# EAGLE design Projek1 (EAGLE 6.6.0)
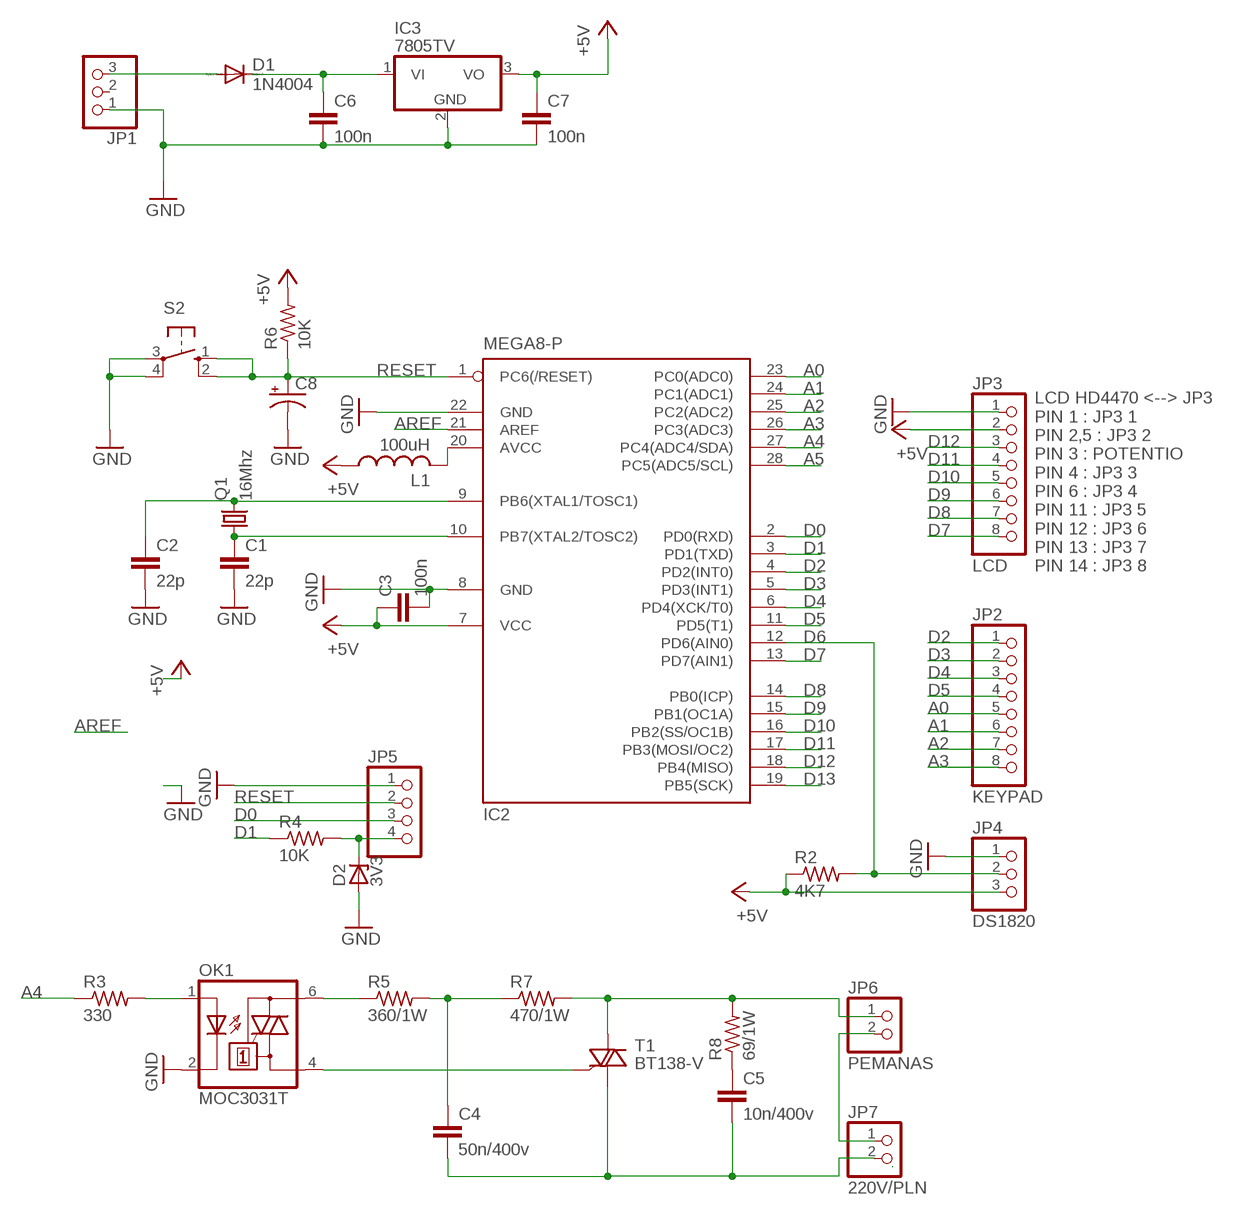
[diagram p0: schematic, sheet 1]

## Parts
C1  22p  C-EU025-025X050  [C025-025X050]
C2  22p  C-EU025-025X050  [C025-025X050]
C3  100n  C-EU050-025X075  [C050-025X075]
C4  50n/400v  C-EU150-064X183  [C150-064X183]
C5  10n/400v  C-EU150-064X183  [C150-064X183]
C6  100n  C-EU050-025X075  [C050-025X075]
C7  100n  C-EU050-025X075  [C050-025X075]
C8  CPOL-USE2-5  [E2-5]
D1  1N4004  [DO41-10]
D2  3V3  ZENER-DIODEDO35Z10  [DO35Z10]
IC2  MEGA8-P  [DIL28-3]
IC3  7805TV  [TO220V]
JP1  PINHD-1X3  [1X03]
JP2  KEYPAD  PINHD-1X8  [1X08]
JP3  LCD  PINHD-1X8  [1X08]
JP4  DS1820  PINHD-1X3  [1X03]
JP5  PINHD-1X4  [1X04]
JP6  PEMANAS  PINHD-1X2  [1X02]
JP7  220V/PLN  PINHD-1X2  [1X02]
L1  100uH  L-US0207/10  [0207/10]
OK1  MOC3031T  [DIL06B]
Q1  16Mhz  CRYSTALHC49U70  [HC49U70]
R2  4K7  R-US_0309/10  [0309/10]
R3  330  R-US_0309/10  [0309/10]
R4  10K  R-US_0309/10  [0309/10]
R5  360/1W  R-US_0414/15  [0414/15]
R6  10K  R-US_0309/10  [0309/10]
R7  470/1W  R-US_0414/15  [0414/15]
R8  69/1W  R-US_0414/15  [0414/15]
S2  10-XX  [B3F-10XX]
T1  BT138-V  [TO220BV]

## Nets
+5V [power]: C3.1 C7.1 IC2.7(VCC) IC3.3(VO) JP3.2 JP4.3 L1.1 R2.1 R6.2
A0: IC2.23(PC0(ADC0)) JP2.5
A1: IC2.24(PC1(ADC1)) JP2.6
A2: IC2.25(PC2(ADC2)) JP2.7
A3: IC2.26(PC3(ADC3)) JP2.8
A4: IC2.27(PC4(ADC4/SDA)) R3.1
A5: IC2.28(PC5(ADC5/SCL))
AREF: IC2.21(AREF)
D0: IC2.2(PD0(RXD)) JP5.3
D1: IC2.3(PD1(TXD)) R4.1
D2: IC2.4(PD2(INT0)) JP2.1
D3: IC2.5(PD3(INT1)) JP2.2
D4: IC2.6(PD4(XCK/T0)) JP2.3
D5: IC2.11(PD5(T1)) JP2.4
D6: IC2.12(PD6(AIN0)) JP4.2 R2.2
D7: IC2.13(PD7(AIN1)) JP3.8
D8: IC2.14(PB0(ICP)) JP3.7
D9: IC2.15(PB1(OC1A)) JP3.6
D10: IC2.16(PB2(SS/OC1B)) JP3.5
D11: IC2.17(PB3(MOSI/OC2)) JP3.4
D12: IC2.18(PB4(MISO)) JP3.3
D13: IC2.19(PB5(SCK))
GND: C1.2 C2.2 C3.2 C6.2 C7.2 C8.- D2.A IC2.8(GND) IC2.22(GND) IC3.2(GND) JP1.1 JP3.1 JP4.1 JP5.1 OK1.2(C) S2.3(P) S2.4(P1)
N$1: D1.A JP1.3
N$2: C2.1 IC2.9(PB6(XTAL1/TOSC1)) Q1.2
N$3: C1.1 IC2.10(PB7(XTAL2/TOSC2)) Q1.1
N$4: C6.1 D1.C IC3.1(VI)
N$5: IC2.20(AVCC) L1.2
N$6: OK1.1(A) R3.2
N$7: D2.C JP5.4 R4.2
N$8: OK1.4(A1) T1.G
N$9: JP6.1 R7.2 R8.2 T1.T2(A2)
N$10: OK1.6(A2) R5.1
N$11: C4.1 R5.2 R7.1
N$12: C4.2 C5.2 JP7.2 T1.T1(A1)
N$13: C5.1 R8.1
N$15: JP6.2 JP7.1
RESET: C8.+ IC2.1(PC6(/RESET)) JP5.2 R6.1 S2.1(S) S2.2(S1)
Unconnected: JP1.2

## Notes on the sheet
- LCD HD4470 <--> JP3
  PIN 1 : JP3 1
  PIN 2,5 : JP3 2
  PIN 3 : POTENTIO
  PIN 4 : JP3 3 
  PIN 6 : JP3 4
  PIN 11 : JP3 5
  PIN 12 : JP3 6
  PIN 13 : JP3 7
  PIN 14 : JP3 8

## Library data of the parts
C1-C7 = rcl:C-EU: CAPACITOR, European symbol
C8 = rcl:CPOL-US: POLARIZED CAPACITOR, American symbol
D1 = diode:1N4004: DIODE general purpose rectifier, 1 A
D2 = diode:ZENER-DIODE: Z-Diode
IC2 = atmel:MEGA8-P: MICROCONTROLLER 8 Kbytes FLASH, 1 kbytes SRAM, 512 bytes EEPROM, USART, 4-channel 10 bit ADC, 2-channel 8 bit ADC Pin compatible with Atmega48, ATMega88, ATMega168 Source: avr.lbr; OC_FARNELL: unknown; OC_NEWARK: unknown
IC3 = linear:78*: Positive VOLTAGE REGULATOR Source: http://cache.national.com/ds/LM/LM78L05.pdf http://www.fairchildsemi.com/ds/LM/LM7805.pdf
JP1 JP4 = pinhead:PINHD-1X3: PIN HEADER
JP2 JP3 = pinhead:PINHD-1X8: PIN HEADER
JP5 = pinhead:PINHD-1X4: PIN HEADER
JP6 JP7 = pinhead:PINHD-1X2: PIN HEADER
L1 = rcl:L-US: INDUCTOR, American symbol
OK1 = optocoupler:MOC30*: 6-Pin DIP Zero-Cross Optoisolators Triac Driver Output (250/400 Volt Peak) Source: Data sheet <http://www.fairchildsemi.com/ds/MO/MOC3031M.pdf> The old path of data sheet not more available 2013-05-06.; OC_FARNELL: unknown; OC_NEWARK: unknown
Q1 = crystal:CRYSTAL: CRYSTAL; OC_FARNELL: unknown; OC_NEWARK: unknown
R2-R8 = rcl:R-US_: RESISTOR, American symbol
S2 = switch-omron:10-XX: OMRON SWITCH; MPN: B3F-1000; OC_FARNELL: 176432; OC_NEWARK: 36M3542
T1 = triac:BT138: TRIAC Source: http://www.semiconductors.philips.com BT138_SERIES_2.pdf

## Net classes
1 power: width 0.61 mm

## Board
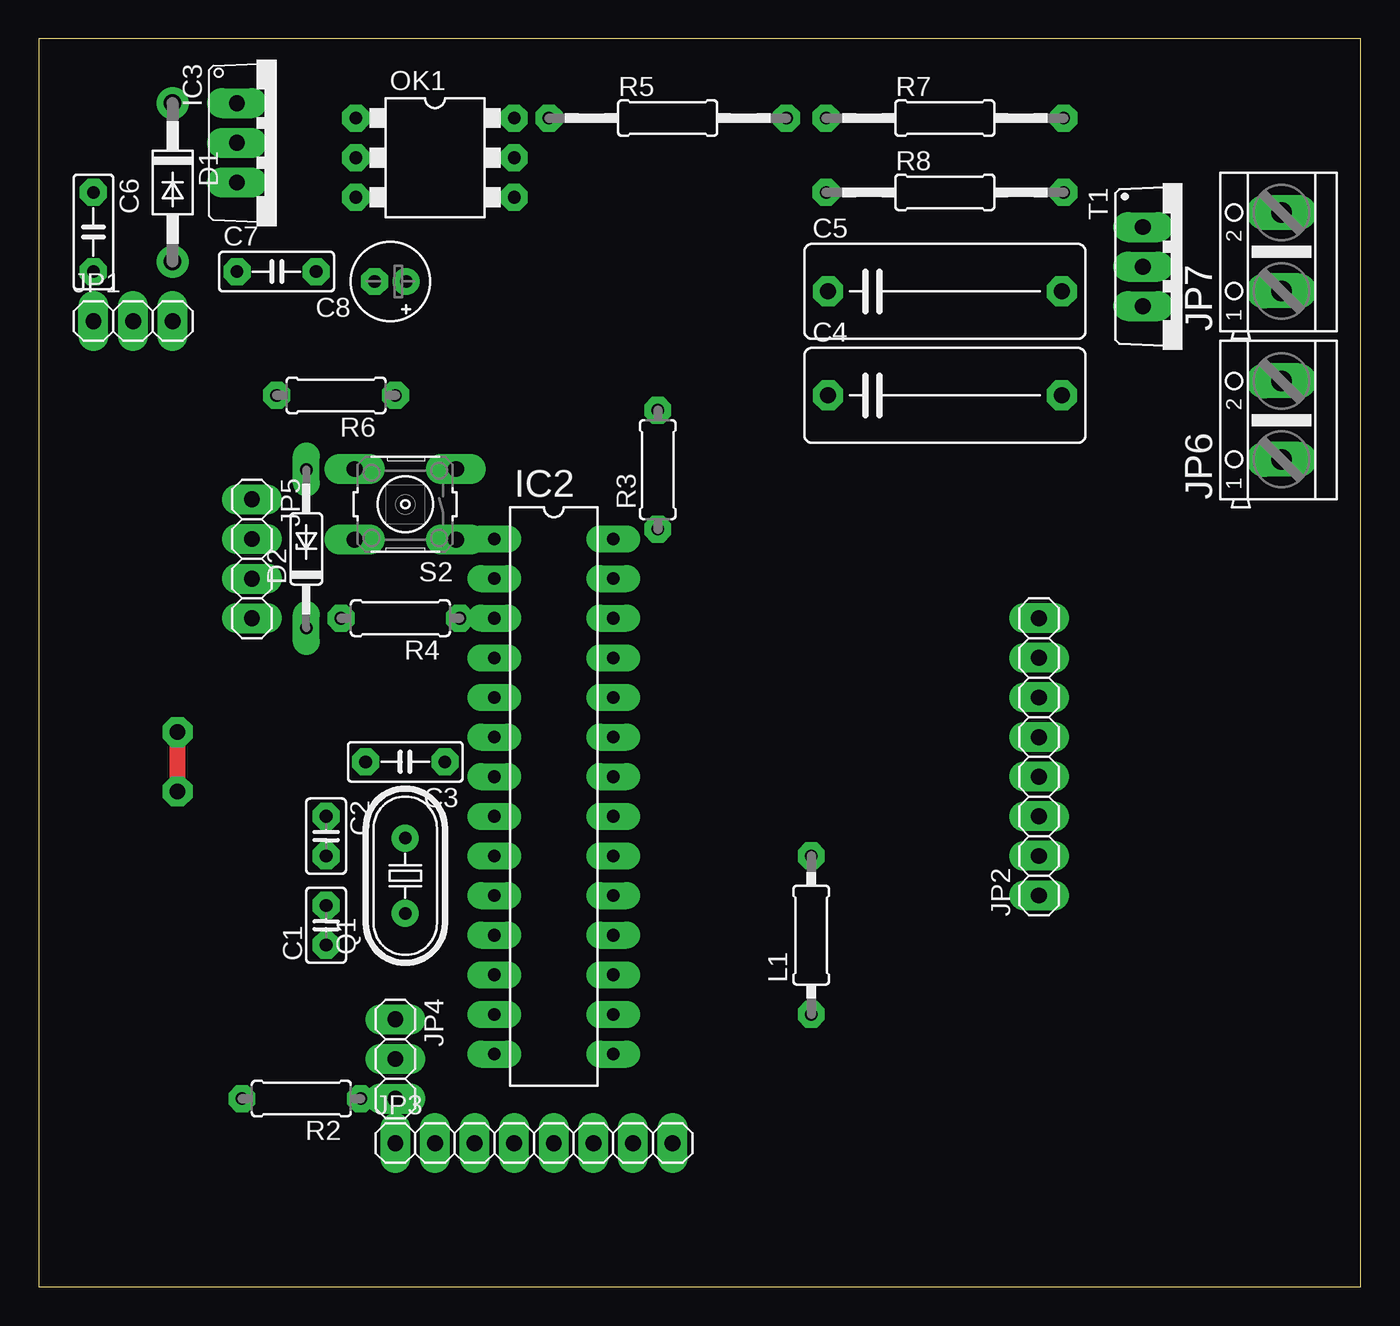
[diagram p1: board, top side]
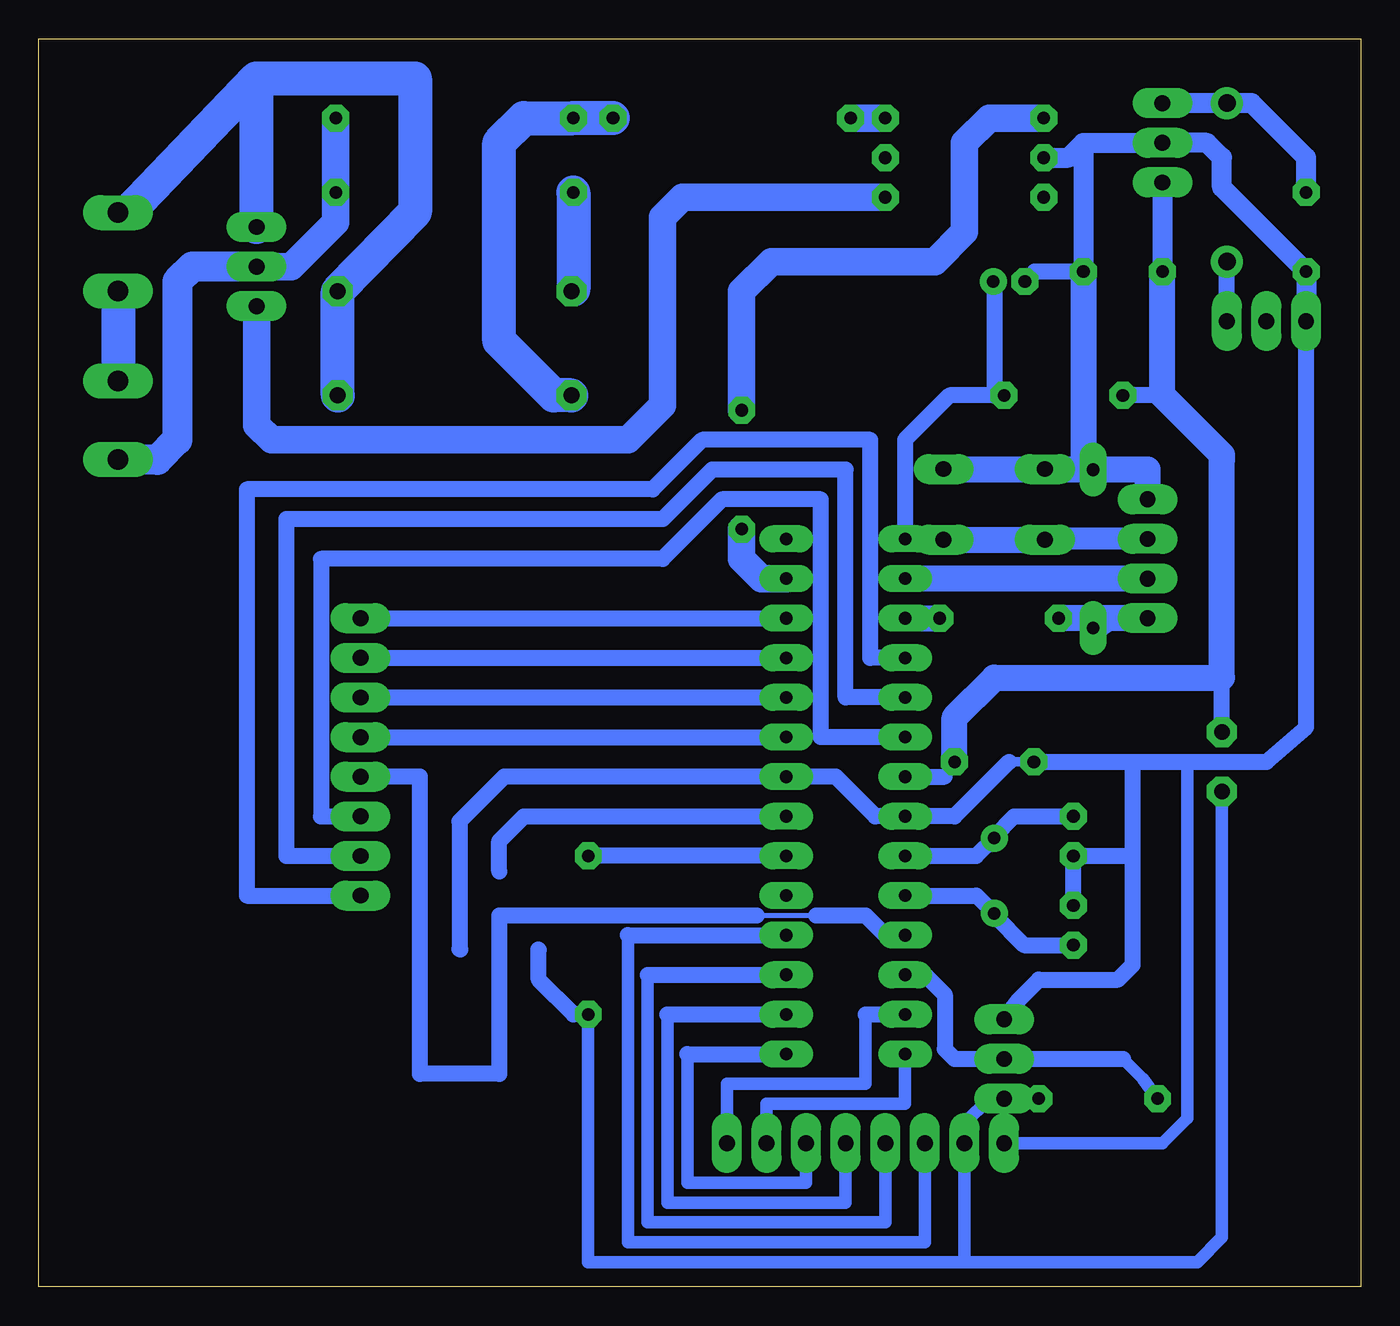
[diagram p2: board, bottom side, seen from below]

Size 84.76 x 80 mm. Coordinates in mm from the lower left corner, seen from the top.
Outline: 0,0 84.76,0 84.76,80 0,80 0,0
Copper layers (1*16): Top 0.035mm / dielectric 1.5mm / Bottom 0.035mm
Design rules "YooCNC2": minimum track width 12mil, minimum drill 20mil, track to track 10mil, track to pad 10mil, pad to pad 10mil, via to via 10mil, smd to smd 10mil, copper to edge 20mil, drill to drill 40mil, minimum pad ring 18mil, minimum via ring 18mil, stop-mask expansion 8mil, vias tented up to drill 0mil, thermal gap 10mil

### Footprints (pad centres in the part's own frame; a part is rotated, then mirrored left to right if it is on the bottom)
C025-025X050 = drill 0.813 octagon: 1 -1.27,0; 2 1.27,0
C050-025X075 = drill 0.813 octagon: 1 -2.54,0; 2 2.54,0
C150-064X183 = drill 1.016 octagon: 1 -7.493,0; 2 7.493,0
E2-5 = drill 0.813 pad 1.27: + -1.016,0 | drill 0.813 pad 1.27 octagon: - 1.016,0
DO41-10 = drill 1.118: A 5.08,0; C -5.08,0
DO35Z10 = drill 0.813 long: A 5.08,0; C -5.08,0
DIL28-3 = drill 0.813 long: 1 -16.51,-3.81; 2 -13.97,-3.81; 3 -11.43,-3.81; 4 -8.89,-3.81; 5 -6.35,-3.81; 6 -3.81,-3.81; 7 -1.27,-3.81; 8 1.27,-3.81; 9 3.81,-3.81; 10 6.35,-3.81; 11 8.89,-3.81; 12 11.43,-3.81; 13 13.97,-3.81; 14 16.51,-3.81; 15 16.51,3.81; 16 13.97,3.81; 17 11.43,3.81; 18 8.89,3.81; 19 6.35,3.81; 20 3.81,3.81; 21 1.27,3.81; 22 -1.27,3.81; 23 -3.81,3.81; 24 -6.35,3.81; 25 -8.89,3.81; 26 -11.43,3.81; 27 -13.97,3.81; 28 -16.51,3.81
TO220V = drill 1.016 long: 1 -2.54,-2.54; 2 0,-2.54; 3 2.54,-2.54
1X03 = drill 1.016 long: 1 -2.54,0; 2 0,0; 3 2.54,0
1X08 = drill 1.016 long: 1 -8.89,0; 2 -6.35,0; 3 -3.81,0; 4 -1.27,0; 5 1.27,0; 6 3.81,0; 7 6.35,0; 8 8.89,0
1X04 = drill 1.016 long: 1 -3.81,0; 2 -1.27,0; 3 1.27,0; 4 3.81,0
AK500/2 = drill 1.321 long: 1 -2.515,0; 2 2.515,0
0207/10 = drill 0.813 octagon: 1 -5.08,0; 2 5.08,0
DIL06B = drill 0.813 octagon: 1 -2.54,-5.08; 2 0,-5.08; 3 2.54,-5.08; 4 2.54,5.08; 5 0,5.08; 6 -2.54,5.08
HC49U70 = drill 0.813: 1 -2.413,0; 2 2.413,0
0207/7 = drill 0.813 octagon: 1 -3.81,0; 2 3.81,0
0207/15 = drill 0.813 octagon: 1 -7.62,0; 2 7.62,0
B3F-10XX = drill 1.016 long: 1 -3.251,2.261; 2 3.251,2.261; 3 -3.251,-2.261; 4 3.251,-2.261
TO220BV = drill 1.016 long: G 2.54,-2.54; T1 -2.54,-2.54; T2 0,-2.54

### Placement (x,y rotation side)
C1  18.41,23.18 90 top
C2  18.41,28.89 270 top
C3  23.5,33.66 180 top
C4  58.1,57.15 0 top
C5  58.1,63.82 0 top
C6  3.49,67.63 270 top
C7  15.24,65.09 0 top
C8  22.54,64.45 180 top
D1  8.57,70.8 270 top
D2  17.14,47.31 90 top
IC2  33.02,31.43 270 top
IC3  15.24,73.34 270 top
JP1  6.03,61.91 0 top
JP2  64.14,33.97 90 top
JP3  31.75,9.21 0 top
JP4  22.86,14.61 270 top
JP5  13.65,46.67 270 top
JP6  PEMANAS  [AK500/2]  79.69,55.56 90 top
JP7  220V/PLN  [AK500/2]  79.69,66.36 90 top
L1  49.53,22.54 90 top
OK1  25.4,72.39 270 top
Q1  23.5,26.35 90 top
R2  4K7  [0207/7]  16.83,12.06 180 top
R3  330  [0207/7]  39.69,52.39 90 top
R4  10K  [0207/7]  23.18,42.86 180 top
R5  360/1W  [0207/15]  40.32,74.93 0 top
R6  10K  [0207/7]  19.05,57.15 180 top
R7  470/1W  [0207/15]  58.1,74.93 0 top
R8  69/1W  [0207/15]  58.1,70.17 0 top
S2  23.5,50.16 180 top
T1  73.34,65.41 270 top

### Tracks (layer width: path | path; a pad name or v marks a point on that pad's centre or on a via)
+5V  (via drill 1)
  Top 1.016: v8.89,31.75 v8.89,35.56
  Bottom 0.61: 26.67,32.7 C3.1
  Bottom 0.813: 25.4,1.59 JP3.2 25.4,10.48 23.81,12.06 JP4.3 R2.1 | L1.1 49.53,1.59 25.4,1.59 | 25.4,1.59 10.48,1.59 8.89,3.17 v8.89,31.75
  Bottom 1.016: IC2.7 26.67,32.7 | v8.89,35.56 8.89,39.05 | L1.1 50.48,17.46 52.7,19.68 52.7,21.59 52.74,21.63 | 8.89,53.02 8.89,53.34 | 12.7,57.15 R6.2
  Bottom 1.27: IC3.3 C7.1
  Bottom 1.676: 8.89,53.34 12.7,57.15 C7.1 | C3.1 26.04,36.51 23.5,39.05 8.89,39.05 8.89,53.02
A0
  Bottom 1.016: JP2.5 IC2.23
A1
  Bottom 1.016: JP2.6 IC2.24
A2
  Bottom 1.016: JP2.7 IC2.25
A3
  Bottom 1.016: JP2.8 IC2.26
A4
  Bottom 1.778: IC2.27 38.42,45.4 39.69,46.67 R3.1
AREF
  Bottom 1.016: 55.24,26.63 55.24,28.57 53.66,30.16 IC2.21
D0
  Bottom 1.676: JP5.3 IC2.2
D1
  Bottom 1.676: IC2.3 R4.1
D2
  Bottom 1.016: JP2.1 71.44,25.08 71.44,51.12 45.4,51.12 42.23,54.29 31.43,54.29 31.43,40.32 IC2.4
D3
  Bottom 1.016: IC2.5 33.02,37.78 33.02,52.39 41.59,52.39 44.77,49.21 68.9,49.21 68.9,27.62 JP2.2
D4
  Bottom 1.016: IC2.6 34.61,35.24 34.61,50.48 40.96,50.48 44.77,46.67 66.67,46.67 66.67,30.16 JP2.3
D5
  Bottom 0.305: 38.73,23.81 34.92,23.81
  Bottom 0.61: IC2.11 30.48,22.54
  Bottom 1.016: 38.73,23.81 55.24,23.81 55.24,13.65 60.33,13.65 60.33,32.7 JP2.4 | 34.92,23.81 31.75,23.81 30.48,22.54
D6
  Bottom 0.813: 15.24,14.61 13.97,13.34 R2.2
  Bottom 1.016: 15.24,14.61 JP4.2 26.04,14.61 26.67,15.24 26.67,18.73 27.94,20 IC2.12
D7
  Bottom 0.813: JP3.8 40.64,13.02 31.75,13.02 31.75,17.46
  Bottom 1.016: 31.75,17.46 IC2.13
D8
  Bottom 0.813: JP3.7 38.1,11.75 29.21,11.75 IC2.14
D9
  Bottom 0.813: JP3.6 35.56,6.67 43.18,6.67 43.18,14.92
  Bottom 1.016: 43.18,14.92 IC2.15
D10
  Bottom 0.813: JP3.5 33.02,5.4 44.45,5.4 44.45,17.46
  Bottom 1.016: 44.45,17.46 IC2.16
D11
  Bottom 0.813: JP3.4 30.48,4.13 45.72,4.13 45.72,20
  Bottom 1.016: 45.72,20 IC2.17
D12
  Bottom 0.813: JP3.3 27.94,2.86 46.99,2.86 46.99,22.54
  Bottom 1.016: 46.99,22.54 IC2.18
GND
  Bottom 0.61: C3.2 22.54,33.66
  Bottom 0.813: JP3.1 12.7,9.21 11.11,10.79 11.11,33.66
  Bottom 1.016: C1.2 C2.2 14.61,27.62 | 22.54,33.66 26.04,30.16 IC2.8 31.11,30.16 33.66,32.7 IC2.22 54.93,32.7 57.78,29.84 57.78,21.67 57.74,21.63 | C3.2 14.61,33.66 | 14.61,33.66 11.11,33.66 6.03,33.66 3.49,35.88 JP1.1 | 14.61,27.62 14.61,33.66 | JP4.1 21.91,18.41 20.64,19.68 15.56,19.68 14.61,20.64 14.61,27.62 | C7.2 20.89,65.09 C8.-
  Bottom 1.27: JP1.1 C6.2 8.89,70.48 8.89,72.39 9.84,73.34 IC3.2 17.78,73.34 | OK1.2 18.73,72.39 17.78,73.34 | 17.78,73.34 C7.2
  Bottom 1.676: JP5.1 13.65,52.39 D2.A 17.78,52.39 | 17.78,52.39 20.21,52.39 S2.4 S2.3 | C7.2 17.78,52.39
N$1
  Bottom 1.016: JP1.3 D1.A
N$2
  Bottom 0.61: Q1.2 23.5,28.89
  Bottom 1.016: IC2.9 24.64,27.62 Q1.2 | 23.5,28.89 22.23,30.16 C2.1
N$3
  Bottom 0.61: Q1.1 23.5,23.81
  Bottom 1.016: IC2.10 24.64,25.08 Q1.1 | 23.5,23.81 21.59,21.91 C1.1
N$4
  Bottom 1.27: IC3.1 D1.C 6.99,75.88 3.49,72.39 C6.1
N$5
  Bottom 1.016: IC2.20 L1.2
N$6
  Bottom 1.778: R3.2 39.69,63.82 37.78,65.72 27.3,65.72 25.4,67.63 25.4,73.34 23.81,74.93 OK1.1
N$7
  Bottom 1.676: JP5.4 16.19,42.86 | 16.19,42.86 R4.2 | D2.C 16.19,42.86
N$8
  Bottom 1.778: T1.G 70.8,55.24 69.85,54.29 46.99,54.29 44.77,56.52 44.77,68.58 43.5,69.85 OK1.4
N$9
  Bottom 1.778: R7.2 R8.2 65.72,68.26 68.58,65.41 T1.T2
  Bottom 1.93: T1.T2 74.93,65.41 75.88,64.45 75.88,54.29 77.15,53.02 79.67,53.02 JP6.1
N$10
  Bottom 1.778: OK1.6 R5.1
N$11
  Bottom 2.184: C4.1 51.75,57.15 55.24,60.64 55.24,73.34 53.66,74.93 R7.1 R5.2
N$12
  Bottom 2.184: T1.T1 70.8,77.47 | 70.8,77.47 60.64,77.47 60.64,68.9 C5.2 C4.2 | JP7.2 79.08,68.87 70.8,77.47
N$13
  Bottom 1.27: 50.48,63.94 C5.1
  Bottom 2.184: R8.1 50.48,63.94
N$15
  Bottom 2.184: JP7.1 JP6.2
RESET
  Bottom 1.016: R6.1 23.5,57.15 | 23.5,57.15 26.35,57.15 29.21,54.29 IC2.1 | C8.+ 23.5,64.45 23.5,57.15
  Bottom 1.422: JP5.2 20.24,47.94 S2.2
  Bottom 1.676: IC2.1 26.78,47.94 S2.1 S2.2